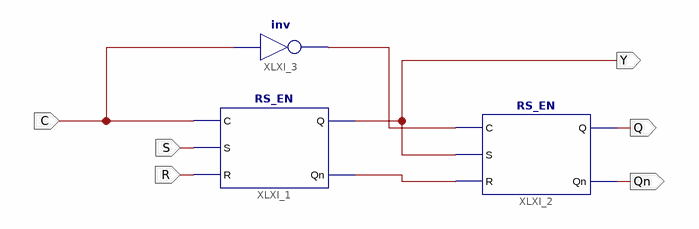
[diagram p0: schematic sheet 1]
// Xilinx ISE schematic RS_Trig.sch (kintex7) as structural Verilog: 3 symbols, 6 ports
module RS_Trig (
  input  C,
  input  S,
  input  R,
  output Q,
  output Qn,
  output Y
);

  wire XLXN_9, Yn;

  RS_EN XLXI_1 (.C(C), .S(S), .R(R), .Q(Y), .Qn(Yn));
  RS_EN XLXI_2 (.C(XLXN_9), .S(Y), .R(Yn), .Q(Q), .Qn(Qn));
  not XLXI_3 (XLXN_9, C);
endmodule
